# EAGLE schematic boop (EAGLE 9.6.2)
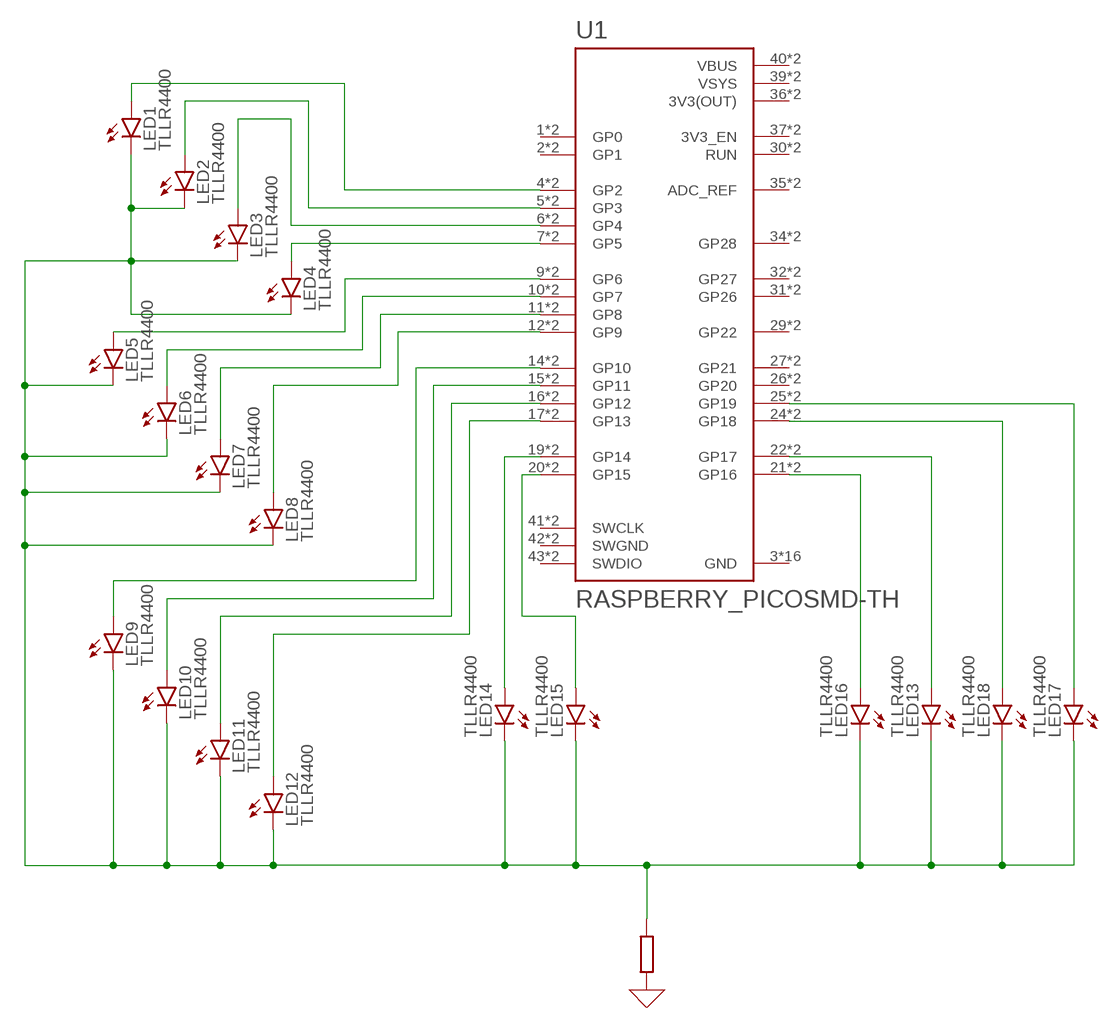
[diagram p0: schematic, sheet 1]

## Parts
LED1  TLLR4400  [LED3MM]
LED2  TLLR4400  [LED3MM]
LED3  TLLR4400  [LED3MM]
LED4  TLLR4400  [LED3MM]
LED5  TLLR4400  [LED3MM]
LED6  TLLR4400  [LED3MM]
LED7  TLLR4400  [LED3MM]
LED8  TLLR4400  [LED3MM]
LED9  TLLR4400  [LED3MM]
LED10  TLLR4400  [LED3MM]
LED11  TLLR4400  [LED3MM]
LED12  TLLR4400  [LED3MM]
LED13  TLLR4400  [LED3MM]
LED14  TLLR4400  [LED3MM]
LED15  TLLR4400  [LED3MM]
LED16  TLLR4400  [LED3MM]
LED17  TLLR4400  [LED3MM]
LED18  TLLR4400  [LED3MM]
U1  RASPBERRY_PICOSMD-TH  [PICO-PKG]

## Nets
N$1: LED1.A U1.4(GP2) U1.P$4(GP2)
N$2: LED2.A U1.5(GP3) U1.P$5(GP3)
N$3: LED3.A U1.6(GP4) U1.P$6(GP4)
N$4: LED4.A U1.7(GP5) U1.P$7(GP5)
N$5: LED5.A U1.9(GP6) U1.P$9(GP6)
N$6: LED6.A U1.10(GP7) U1.P$10(GP7)
N$7: LED7.A U1.11(GP8) U1.P$11(GP8)
N$8: LED8.A U1.12(GP9) U1.P$12(GP9)
N$9: LED9.A U1.14(GP10) U1.P$14(GP10)
N$10: LED10.A U1.15(GP11) U1.P$15(GP11)
N$11: LED11.A U1.16(GP12) U1.P$16(GP12)
N$12: LED12.A U1.17(GP13) U1.P$17(GP13)
N$13: LED14.A U1.19(GP14) U1.P$19(GP14)
N$14: LED15.A U1.20(GP15) U1.P$20(GP15)
N$15: LED16.A U1.21(GP16) U1.P$21(GP16)
N$16: LED13.A U1.22(GP17) U1.P$22(GP17)
N$17: LED18.A U1.24(GP18) U1.P$24(GP18)
N$18: LED17.A U1.25(GP19) U1.P$25(GP19)
RES_GND: LED1.K(C) LED2.K(C) LED3.K(C) LED4.K(C) LED5.K(C) LED6.K(C) LED7.K(C) LED8.K(C) LED9.K(C) LED10.K(C) LED11.K(C) LED12.K(C) LED13.K(C) LED14.K(C) LED15.K(C) LED16.K(C) LED17.K(C) LED18.K(C)
Unconnected: U1.1(GP0) U1.2(GP1) U1.26(GP20) U1.27(GP21) U1.29(GP22) U1.30(RUN) U1.31(GP26) U1.32(GP27) U1.34(GP28) U1.35(ADC_REF) U1.37(3V3_EN) U1.41(SWCLK) U1.43(SWDIO) U1.P$1(GP0) U1.P$2(GP1) U1.P$26(GP20) U1.P$27(GP21) U1.P$29(GP22) U1.P$30(RUN) U1.P$31(GP26) U1.P$32(GP27) U1.P$34(GP28) U1.P$35(ADC_REF) U1.P$37(3V3_EN) U1.P$41(SWCLK) U1.P$43(SWDIO)

## Power pins joined to a net without a drawn wire
3V3(OUT): U1.36(3V3(OUT)) U1.P$36(3V3(OUT))
GND: U1.3(GND) U1.8(GND) U1.13(GND) U1.18(GND) U1.23(GND) U1.28(GND) U1.33(GND) U1.38(GND) U1.P$3(GND) U1.P$8(GND) U1.P$13(GND) U1.P$18(GND) U1.P$23(GND) U1.P$28(GND) U1.P$33(GND) U1.P$38(GND)
SWGND: U1.42(SWGND) U1.P$42(SWGND)
VBUS: U1.40(VBUS) U1.P$40(VBUS)
VSYS: U1.39(VSYS) U1.P$39(VSYS)

## Library data of the parts
LED1-LED18 = led:TLLR4400: Low Current (2mA) LED 3 mm Tinted Diffused Package color RED Source: Data sheet <http://www.farnell.com/datasheets/391100.pdf>; MF: VISHAY SEMICONDUCTOR; OC_FARNELL: 1612437
U1 = RpiPico:RASPBERRY_PICO: Raspberry Pi Pico